# Altium schematic sheet Limit_Switches.SchDoc: RP2040 CNC
size B; Author: AM; CompanyName: Expatria Technologies; DrawnBy: A.Marles; Engineer: AM; Organization: Expatria Technolgoies; DocumentNumber: 7; SheetNumber: 7; SheetTotal: 14
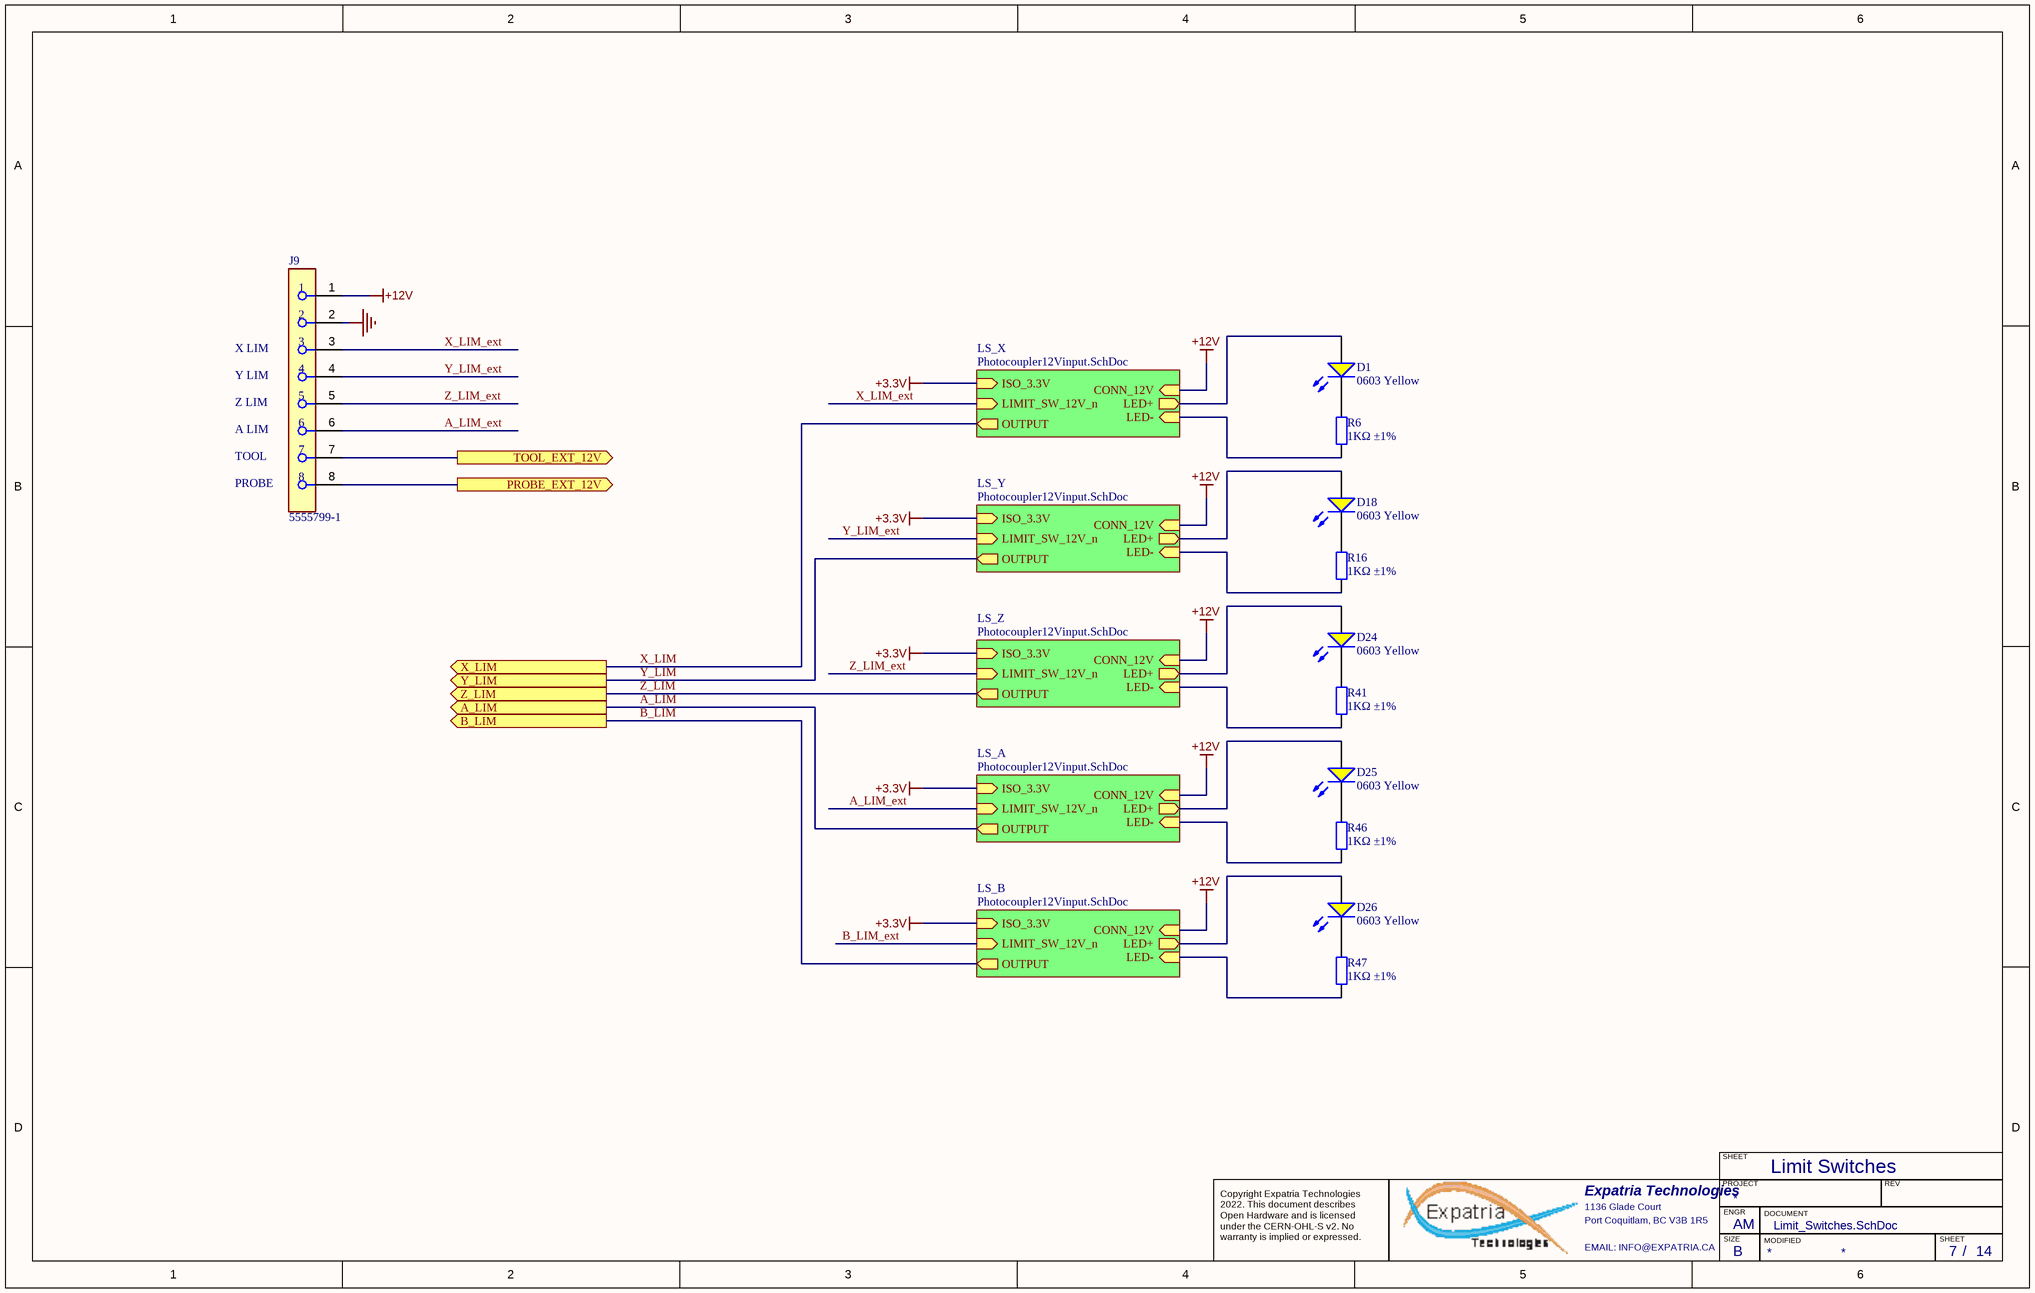
[diagram p0: Limit_Switches.SchDoc]

## Parts
D1  0603 Yellow  [0603_LED_S1]
D18  0603 Yellow  [0603_LED_S1]
D24  0603 Yellow  [0603_LED_S1]
D25  0603 Yellow  [0603_LED_S1]
D26  0603 Yellow  [0603_LED_S1]
J9  5555799-1  [FP-5555799-1-MFG]
R6  1KΩ ±1%  [0603_R]
R16  1KΩ ±1%  [0603_R]
R41  1KΩ ±1%  [0603_R]
R46  1KΩ ±1%  [0603_R]
R47  1KΩ ±1%  [0603_R]

## Sub-sheets
LS_A = Photocoupler12Vinput.SchDoc: OUTPUT (out), LED+ (out), LED- (in), CONN_12V (in), ISO_3.3V (in), LIMIT_SW_12V_n (in)
LS_B = Photocoupler12Vinput.SchDoc: OUTPUT (out), LED+ (out), LED- (in), CONN_12V (in), ISO_3.3V (in), LIMIT_SW_12V_n (in)
LS_X = Photocoupler12Vinput.SchDoc: OUTPUT (out), LED+ (out), LED- (in), CONN_12V (in), ISO_3.3V (in), LIMIT_SW_12V_n (in)
LS_Y = Photocoupler12Vinput.SchDoc: OUTPUT (out), LED+ (out), LED- (in), CONN_12V (in), ISO_3.3V (in), LIMIT_SW_12V_n (in)
LS_Z = Photocoupler12Vinput.SchDoc: OUTPUT (out), LED+ (out), LED- (in), CONN_12V (in), ISO_3.3V (in), LIMIT_SW_12V_n (in)

## Ports
A_LIM (out), B_LIM (out), PROBE_EXT_12V (out), TOOL_EXT_12V (out), X_LIM (out), Y_LIM (out), Z_LIM (out)

## Nets
+3.3V: sheet LS_X/ISO_3.3V, sheet LS_Y/ISO_3.3V, sheet LS_Z/ISO_3.3V, sheet LS_A/ISO_3.3V, sheet LS_B/ISO_3.3V
+12V: J9.1 ; sheet LS_X/CONN_12V, sheet LS_Y/CONN_12V, sheet LS_Z/CONN_12V, sheet LS_A/CONN_12V, sheet LS_B/CONN_12V
GND: J9.2
A_LIM: port A_LIM, sheet LS_A/OUTPUT
A_LIM_ext: J9.6 ; sheet LS_A/LIMIT_SW_12V_n
B_LIM: port B_LIM, sheet LS_B/OUTPUT
B_LIM_ext: sheet LS_B/LIMIT_SW_12V_n
PROBE_EXT_12V: J9.8 ; port PROBE_EXT_12V
TOOL_EXT_12V: J9.7 ; port TOOL_EXT_12V
X_LIM: port X_LIM, sheet LS_X/OUTPUT
X_LIM_ext: J9.3 ; sheet LS_X/LIMIT_SW_12V_n
Y_LIM: port Y_LIM, sheet LS_Y/OUTPUT
Y_LIM_ext: J9.4 ; sheet LS_Y/LIMIT_SW_12V_n
Z_LIM: port Z_LIM, sheet LS_Z/OUTPUT
Z_LIM_ext: J9.5 ; sheet LS_Z/LIMIT_SW_12V_n
NetD1_A: D1.A ; sheet LS_X/LED+
NetD1_K: D1.K R6.1
NetD18_A: D18.A ; sheet LS_Y/LED+
NetD18_K: D18.K R16.1
NetD24_A: D24.A ; sheet LS_Z/LED+
NetD24_K: D24.K R41.1
NetD25_A: D25.A ; sheet LS_A/LED+
NetD25_K: D25.K R46.1
NetD26_A: D26.A ; sheet LS_B/LED+
NetD26_K: D26.K R47.1
NetR6_2: R6.2 ; sheet LS_X/LED-
NetR16_2: R16.2 ; sheet LS_Y/LED-
NetR41_2: R41.2 ; sheet LS_Z/LED-
NetR46_2: R46.2 ; sheet LS_A/LED-
NetR47_2: R47.2 ; sheet LS_B/LED-

## Notes on the sheet
- (near J9) X LIM
- (near J9) Y LIM
- (near J9) Z LIM
- (near J9) A LIM
- TOOL
- (near J9) PROBE
- Limit Switches
- SHEET
- Expatria Technologies
- 1136 Glade Court
- Port Coquitlam, BC V3B 1R5
- PROJECT
- SIZE
- ENGR
- MODIFIED
- DOCUMENT
- REV
- Copyright Expatria Technologies 2022. This document describes Open Hardware and is licensed under the CERN-OHL-S v2. No warranty is implied or expressed.
- EMAIL: INFO@EXPATRIA.CA
- B
- /

## Library data of the parts
D1 D18 D24-D26 = 0603 LED Yellow: LED; ComponentLink1Description: 供应商链接; ComponentLink1URL: http://www.szlcsc.com/product/details_73147.html; Package: 0603; Supplier: LC; SuppliersPartNumber: C72038; Color: Yellow
J9 = CMP-03371-000003-1: CONN MOD JACK 8P8C VERT UNSHLD; Manufacturer: TE Connectivity; Pitch: 2.54mm; Number Of Contacts: 8; Is Female: yes; Device Class L3: unset; Manufacturer Part Number: 5555799-1; Temperature Range High: +85°C; Temperature Range Low: -40°C; Octopart: https://octopart.com/5555799-1-te+connectivity-39526335; Device Class L1: Connectors; Device Class L2: Modular / Ethernet Connectors; Mouser Description: Conn RJ-45 F 8 POS 2.54mm Solder ST Thru-Hole 8 Terminal 1 Port Cat 3 Box/Package/Tray; Digikey Description: CONN MOD JACK 8P8C VERT UNSHLD; Package: 5555799-1; Temperature: -40°C to +85°C; SuppliersPartNumber: C305983
R6 R16 R41 R46 R47 = 0603 1K (1001) 1%: Chip resistor; Manufacturer: Uniroyal Elec; PartNumber: 0603WAF1001T5E; Power: 1/10W; ComponentLink1Description: Supplier link; ComponentLink1URL: http://www.szlcsc.com/product/details_21904.html; Package: 0603; Supplier: LC; SuppliersPartNumber: C21190; Resistance: 1KΩ; Tolerance: 1%